# Altium schematic sheet LED_Matrix.SchDoc
size A2
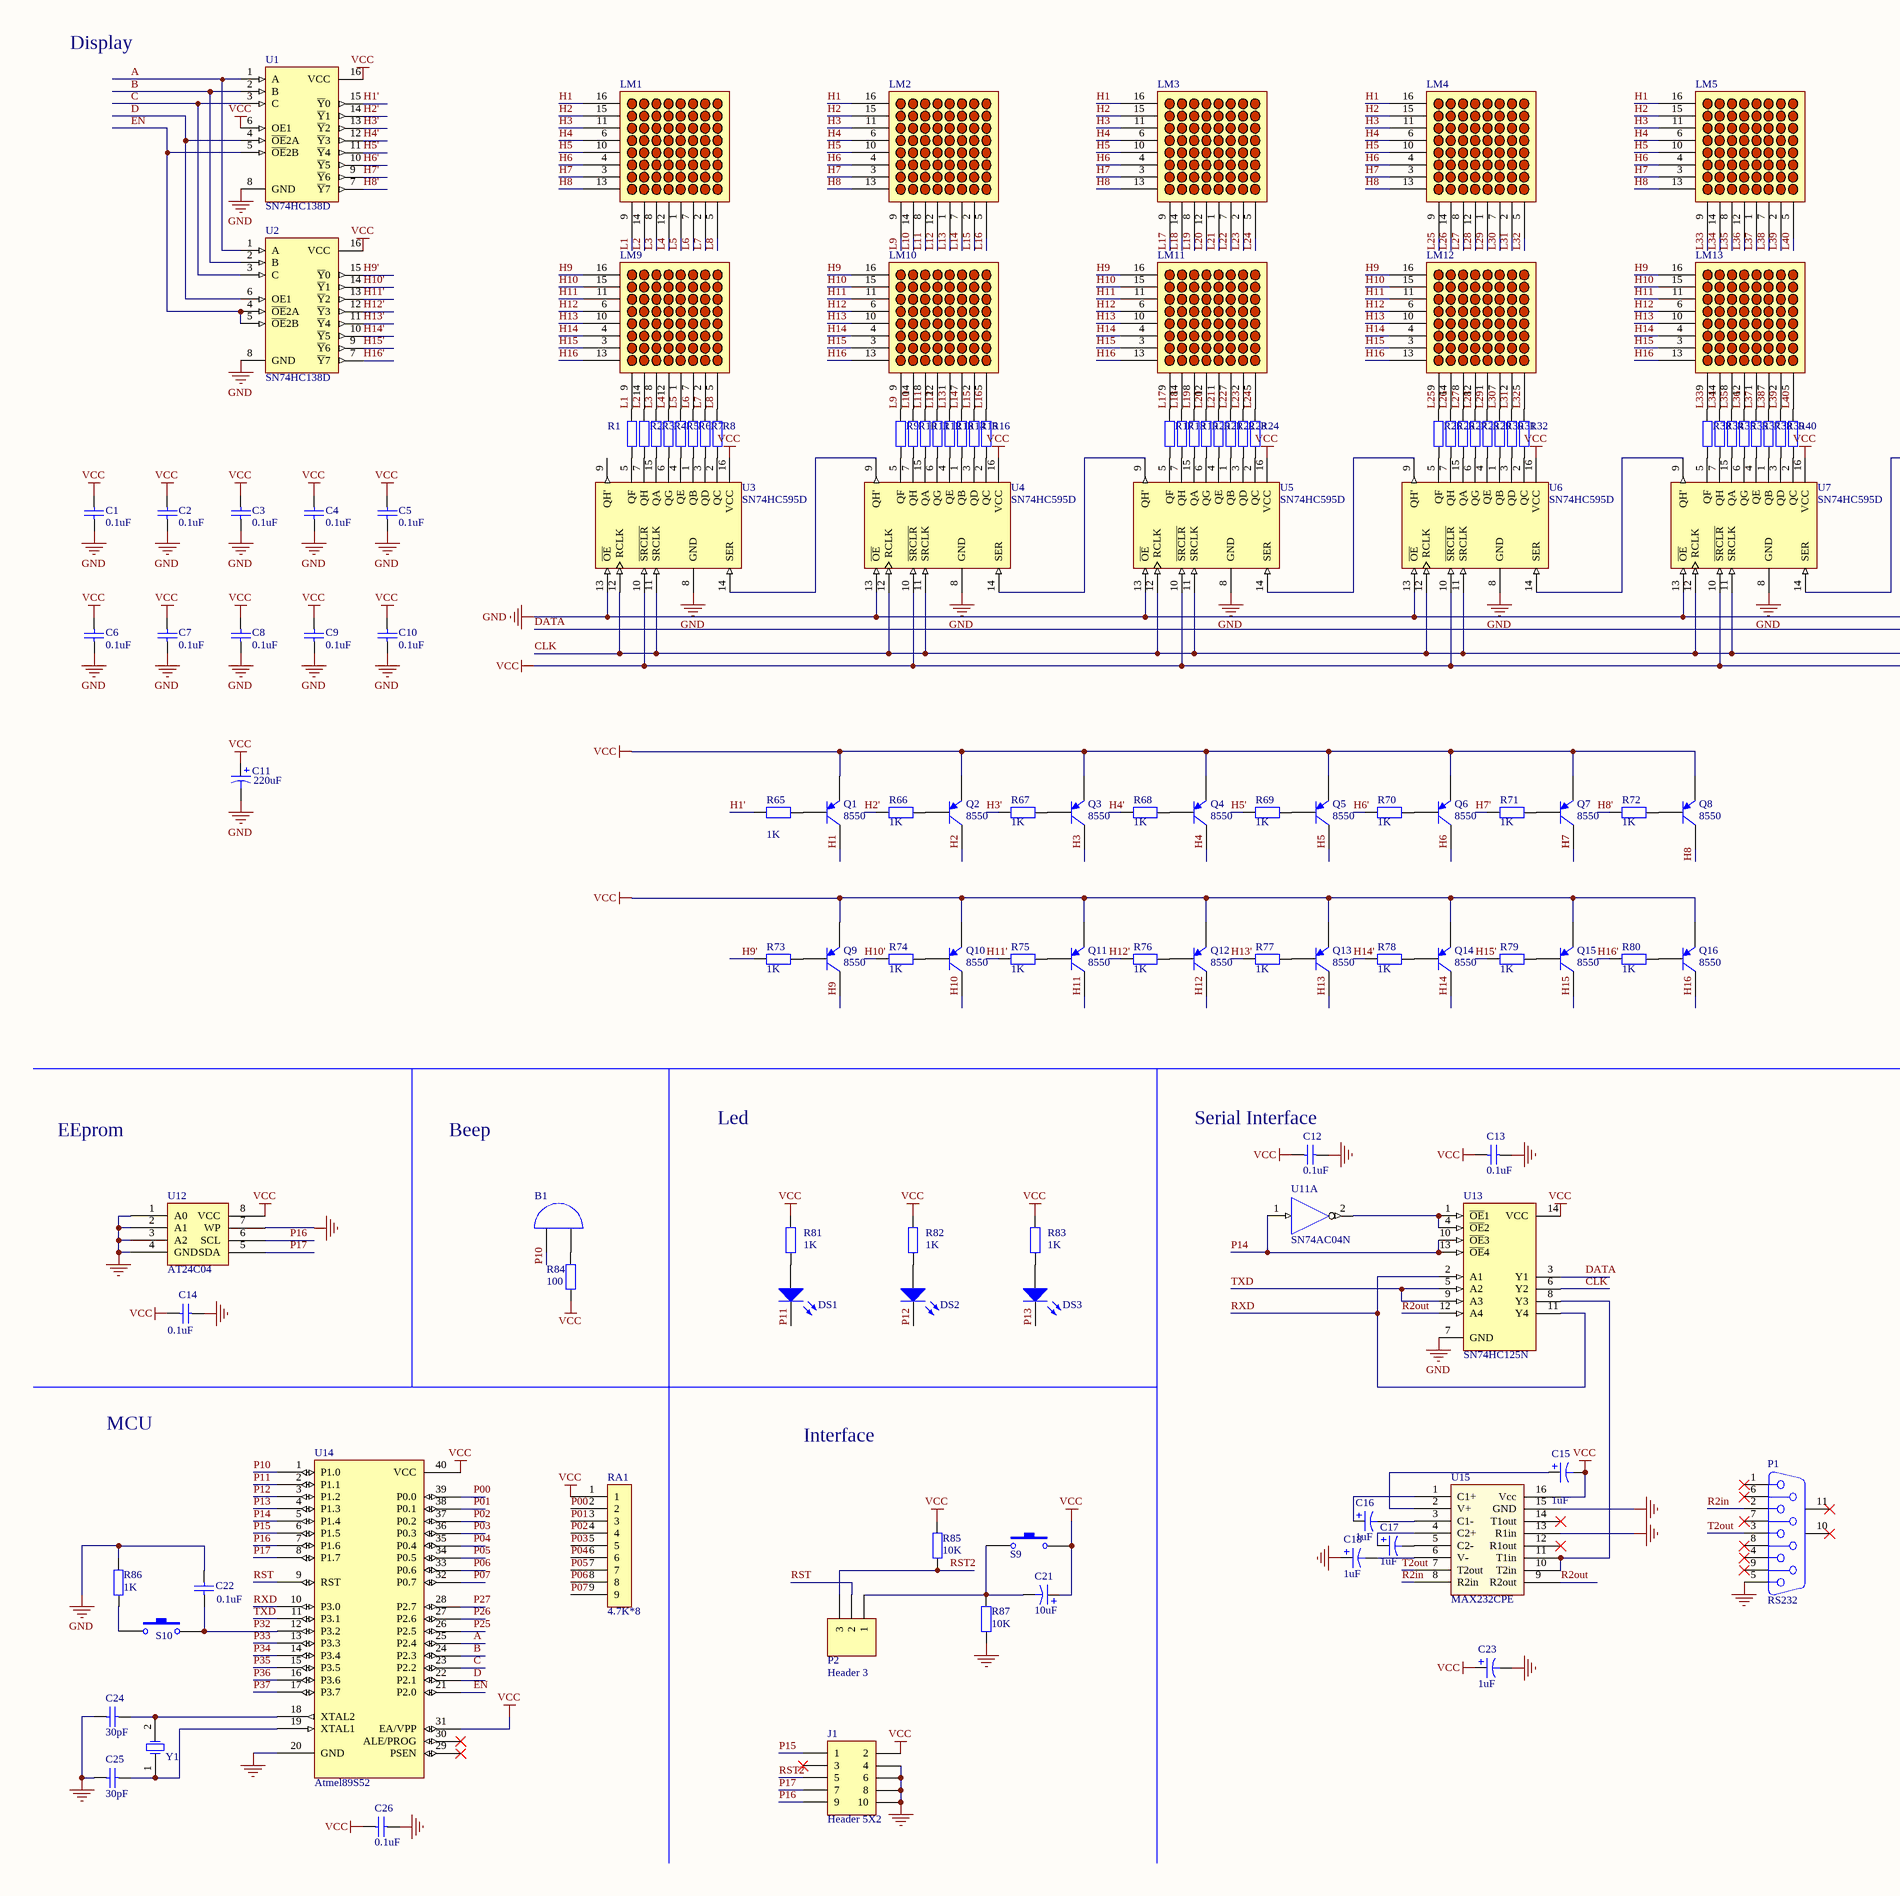
[diagram p0: LED_Matrix.SchDoc, left]
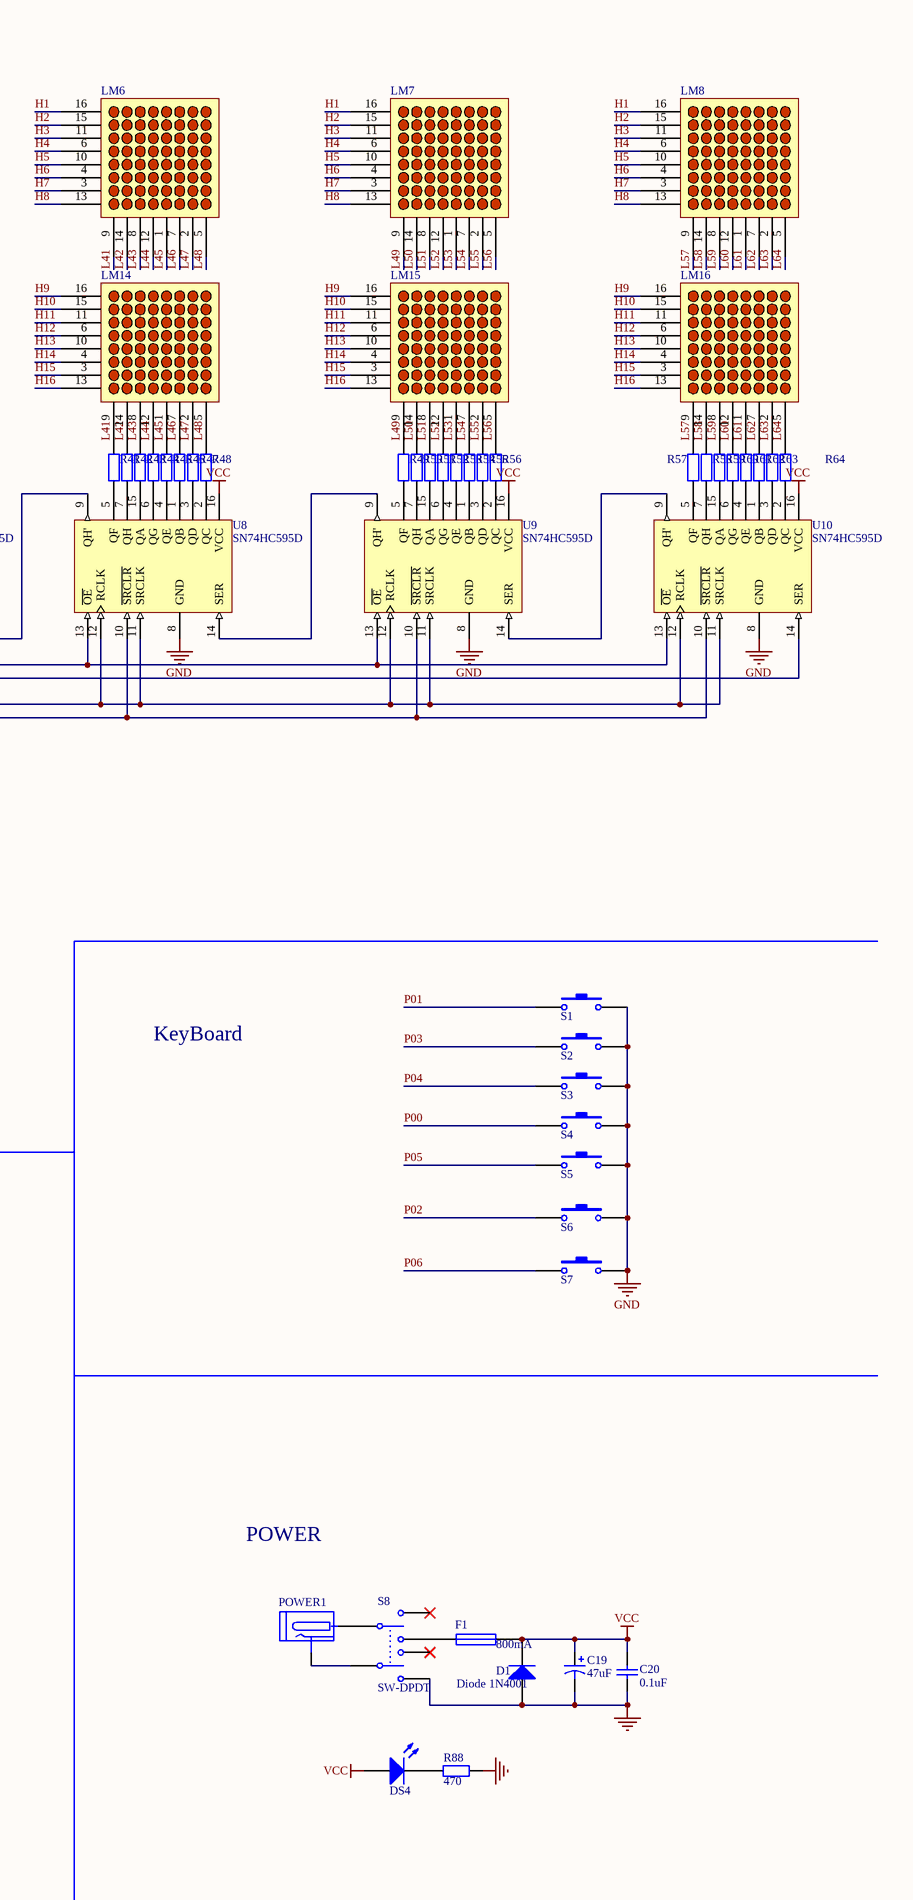
[diagram p1: LED_Matrix.SchDoc, right]

## Parts
B1  BEEP  [Buzzer]  (value not drawn)
C1  value 0.1uF  [C1206]  (hidden comment: Cap Semi)
C2  value 0.1uF  [C1206]  (hidden comment: Cap Semi)
C3  value 0.1uF  [C1206]  (hidden comment: Cap Semi)
C4  value 0.1uF  [C1206]  (hidden comment: Cap Semi)
C5  value 0.1uF  [C1206]  (hidden comment: Cap Semi)
C6  value 0.1uF  [C1206]  (hidden comment: Cap Semi)
C7  value 0.1uF  [C1206]  (hidden comment: Cap Semi)
C8  value 0.1uF  [C1206]  (hidden comment: Cap Semi)
C9  value 0.1uF  [C1206]  (hidden comment: Cap Semi)
C10  value 0.1uF  [C1206]  (hidden comment: Cap Semi)
C11  value 220uF  [CAPPR7.5-16x35]  (hidden comment: Cap Pol1)
C12  value 0.1uF  [VP32-3.2]  (hidden comment: Cap)
C13  value 0.1uF  [VP32-3.2]  (hidden comment: Cap)
C14  value 0.1uF  [VP32-3.2]  (hidden comment: Cap)
C15  value 1uF  [CAP-LED]  (hidden comment: CAP POL)
C16  value 1uF  [CAP-LED]  (hidden comment: CAP POL)
C17  value 1uF  [CAP-LED]  (hidden comment: CAP POL)
C18  value 1uF  [CAP-LED]  (hidden comment: CAP POL)
C19  value 47uF  [CAP-LED]  (hidden comment: CAP POL)
C20  value 0.1uF  [CAP]  (hidden comment: Cap)
C21  value 10uF  [CAP-LED]  (hidden comment: CAP POL)
C22  value 0.1uF  [VP32-3.2]  (hidden comment: Cap)
C23  value 1uF  [CAP-LED]  (hidden comment: CAP POL)
C24  value 30pF  [CAP]  (hidden comment: Cap)
C25  value 30pF  [CAP]  (hidden comment: Cap)
C26  value 0.1uF  [VP32-3.2]  (hidden comment: Cap)
D1  Diode 1N4001  [DIODE-0.4]
DS1  LED  [CAP-LED]  (value not drawn)
DS2  LED  [CAP-LED]  (value not drawn)
DS3  LED  [CAP-LED]  (value not drawn)
DS4  LED  [CAP-LED]  (value not drawn)
F1  value 800mA  [AXIAL-0.3]  (hidden comment: FUSE1)
J1  Header 5X2  [HDR2X5]
LM1  JM-M1088A-B  [LEDMatrix8]  (value not drawn)
LM2  JM-M1088A-B  [LEDMatrix8]  (value not drawn)
LM3  JM-M1088A-B  [LEDMatrix8]  (value not drawn)
LM4  JM-M1088A-B  [LEDMatrix8]  (value not drawn)
LM5  JM-M1088A-B  [LEDMatrix8]  (value not drawn)
LM6  JM-M1088A-B  [LEDMatrix8]  (value not drawn)
LM7  JM-M1088A-B  [LEDMatrix8]  (value not drawn)
LM8  JM-M1088A-B  [LEDMatrix8]  (value not drawn)
LM9  JM-M1088A-B  [LEDMatrix8]  (value not drawn)
LM10  JM-M1088A-B  [LEDMatrix8]  (value not drawn)
LM11  JM-M1088A-B  [LEDMatrix8]  (value not drawn)
LM12  JM-M1088A-B  [LEDMatrix8]  (value not drawn)
LM13  JM-M1088A-B  [LEDMatrix8]  (value not drawn)
LM14  JM-M1088A-B  [LEDMatrix8]  (value not drawn)
LM15  JM-M1088A-B  [LEDMatrix8]  (value not drawn)
LM16  JM-M1088A-B  [LEDMatrix8]  (value not drawn)
P1  RS232  [DSUB1.385-2H9]
P2  Header 3  [HDR1X3]
POWER1  POWER  [Power]  (value not drawn)
Q1  8550  [SOT-23B]
Q2  8550  [SOT-23B]
Q3  8550  [SOT-23B]
Q4  8550  [SOT-23B]
Q5  8550  [SOT-23B]
Q6  8550  [SOT-23B]
Q7  8550  [SOT-23B]
Q8  8550  [SOT-23B]
Q9  8550  [SOT-23B]
Q10  8550  [SOT-23B]
Q11  8550  [SOT-23B]
Q12  8550  [SOT-23B]
Q13  8550  [SOT-23B]
Q14  8550  [SOT-23B]
Q15  8550  [SOT-23B]
Q16  8550  [SOT-23B]
R1  RES  [0805]  (value not drawn)
R2  RES  [0805]  (value not drawn)
R3  RES  [0805]  (value not drawn)
R4  RES  [0805]  (value not drawn)
R5  RES  [0805]  (value not drawn)
R6  RES  [0805]  (value not drawn)
R7  RES  [0805]  (value not drawn)
R8  RES  [0805]  (value not drawn)
R9  RES  [0805]  (value not drawn)
R10  RES  [0805]  (value not drawn)
R11  RES  [0805]  (value not drawn)
R12  RES  [0805]  (value not drawn)
R13  RES  [0805]  (value not drawn)
R14  RES  [0805]  (value not drawn)
R15  RES  [0805]  (value not drawn)
R16  RES  [0805]  (value not drawn)
R17  RES  [0805]  (value not drawn)
R18  RES  [0805]  (value not drawn)
R19  RES  [0805]  (value not drawn)
R20  RES  [0805]  (value not drawn)
R21  RES  [0805]  (value not drawn)
R22  RES  [0805]  (value not drawn)
R23  RES  [0805]  (value not drawn)
R24  RES  [0805]  (value not drawn)
R25  RES  [0805]  (value not drawn)
R26  RES  [0805]  (value not drawn)
R27  RES  [0805]  (value not drawn)
R28  RES  [0805]  (value not drawn)
R29  RES  [0805]  (value not drawn)
R30  RES  [0805]  (value not drawn)
R31  RES  [0805]  (value not drawn)
R32  RES  [0805]  (value not drawn)
R33  RES  [0805]  (value not drawn)
R34  RES  [0805]  (value not drawn)
R35  RES  [0805]  (value not drawn)
R36  RES  [0805]  (value not drawn)
R37  RES  [0805]  (value not drawn)
R38  RES  [0805]  (value not drawn)
R39  RES  [0805]  (value not drawn)
R40  RES  [0805]  (value not drawn)
R41  RES  [0805]  (value not drawn)
R42  RES  [0805]  (value not drawn)
R43  RES  [0805]  (value not drawn)
R44  RES  [0805]  (value not drawn)
R45  RES  [0805]  (value not drawn)
R46  RES  [0805]  (value not drawn)
R47  RES  [0805]  (value not drawn)
R48  RES  [0805]  (value not drawn)
R49  RES  [0805]  (value not drawn)
R50  RES  [0805]  (value not drawn)
R51  RES  [0805]  (value not drawn)
R52  RES  [0805]  (value not drawn)
R53  RES  [0805]  (value not drawn)
R54  RES  [0805]  (value not drawn)
R55  RES  [0805]  (value not drawn)
R56  RES  [0805]  (value not drawn)
R57  RES  [0805]  (value not drawn)
R58  RES  [0805]  (value not drawn)
R59  RES  [0805]  (value not drawn)
R60  RES  [0805]  (value not drawn)
R61  RES  [0805]  (value not drawn)
R62  RES  [0805]  (value not drawn)
R63  RES  [0805]  (value not drawn)
R64  RES  [0805]  (value not drawn)
R65  value 1K  [0805]  (hidden comment: RES)
R66  value 1K  [0805]  (hidden comment: RES)
R67  value 1K  [0805]  (hidden comment: RES)
R68  value 1K  [0805]  (hidden comment: RES)
R69  value 1K  [0805]  (hidden comment: RES)
R70  value 1K  [0805]  (hidden comment: RES)
R71  value 1K  [0805]  (hidden comment: RES)
R72  value 1K  [0805]  (hidden comment: RES)
R73  value 1K  [0805]  (hidden comment: RES)
R74  value 1K  [0805]  (hidden comment: RES)
R75  value 1K  [0805]  (hidden comment: RES)
R76  value 1K  [0805]  (hidden comment: RES)
R77  value 1K  [0805]  (hidden comment: RES)
R78  value 1K  [0805]  (hidden comment: RES)
R79  value 1K  [0805]  (hidden comment: RES)
R80  value 1K  [0805]  (hidden comment: RES)
R81  value 1K  [AXIAL-0.4]  (hidden comment: RES)
R82  value 1K  [AXIAL-0.4]  (hidden comment: RES)
R83  value 1K  [AXIAL-0.4]  (hidden comment: RES)
R84  value 100  [AXIAL-0.4]  (hidden comment: RES)
R85  value 10K  [AXIAL-0.4]  (hidden comment: RES)
R86  value 1K  [AXIAL-0.4]  (hidden comment: RES)
R87  value 10K  [AXIAL-0.4]  (hidden comment: RES)
R88  value 470  [AXIAL-0.4]  (hidden comment: RES)
RA1  value 4.7K*8  [HDR1X9]  (hidden comment: Res Arry)
S1  SW-PB  [key]  (value not drawn)
S2  SW-PB  [key]  (value not drawn)
S3  SW-PB  [key]  (value not drawn)
S4  SW-PB  [key]  (value not drawn)
S5  SW-PB  [key]  (value not drawn)
S6  SW-PB  [key]  (value not drawn)
S7  SW-PB  [key]  (value not drawn)
S8  SW-DPDT  [SWITCH-6]
S9  SW-PB  [key]  (value not drawn)
S10  SW-PB  [key]  (value not drawn)
U1  SN74HC138D  [D016_N]
U2  SN74HC138D  [D016_N]
U3  SN74HC595D  [D016_N]
U4  SN74HC595D  [D016_N]
U5  SN74HC595D  [D016_N]
U6  SN74HC595D  [D016_N]
U7  SN74HC595D  [D016_N]
U8  SN74HC595D  [D016_N]
U9  SN74HC595D  [D016_N]
U10  SN74HC595D  [D016_N]
U11  SN74AC04N  [N014]  (part A of 6)
U12  AT24C04  [DIP-8]
U13  SN74HC125N  [N014]
U14  Atmel89S52  [ATMEL89S52-DIP40]
U15  MAX232CPE  [DIP-16]
Y1  XTAL  [XTAL]  (value not drawn)

## Nets
GND: C1.1 C2.1 C3.1 C4.1 C5.1 C6.1 C7.1 C8.1 C9.1 C10.1 C11.2 C12.2 C13.2 C14.2 C18.1 C19.2 C20.2 C22.2 C23.2 C24.1 C25.1 C26.2 D1.1(A) J1.4 J1.6 J1.8 J1.10 P1.5 R86.2 R87.1 R88.2 S1.2 S2.2 S3.2 S4.2 S5.2 S6.2 S7.2 S8.6 U1.8(GND) U2.8(GND) U3.8(GND) U3.13(~{OE}) U4.8(GND) U4.13(~{OE}) U5.8(GND) U5.13(~{OE}) U6.8(GND) U6.13(~{OE}) U7.8(GND) U7.13(~{OE}) U8.8(GND) U8.13(~{OE}) U9.8(GND) U9.13(~{OE}) U10.8(GND) U10.13(~{OE}) U11.7(GND) U12.1(A0) U12.2(A1) U12.3(A2) U12.4(GND) U12.7(WP) U13.7(GND) U14.20(GND) U15.13(R1in) U15.15(GND)
VCC: C1.2 C2.2 C3.2 C4.2 C5.2 C6.2 C7.2 C8.2 C9.2 C10.2 C11.1 C12.1 C13.1 C14.1 C15.2 C19.1 C20.1 C21.1 C23.1 C26.1 D1.2(K) DS4.1(A) F1.2 J1.2 Q1.3(E) Q2.3(E) Q3.3(E) Q4.3(E) Q5.3(E) Q6.3(E) Q7.3(E) Q8.3(E) Q9.3(E) Q10.3(E) Q11.3(E) Q12.3(E) Q13.3(E) Q14.3(E) Q15.3(E) Q16.3(E) R81.2 R82.2 R83.2 R84.2 R85.1 RA1.1 S9.2 U1.6(OE1) U1.16(VCC) U2.16(VCC) U3.10(~{SRCLR}) U3.16(VCC) U4.10(~{SRCLR}) U4.16(VCC) U5.10(~{SRCLR}) U5.16(VCC) U6.10(~{SRCLR}) U6.16(VCC) U7.10(~{SRCLR}) U7.16(VCC) U8.10(~{SRCLR}) U8.16(VCC) U9.10(~{SRCLR}) U9.16(VCC) U10.10(~{SRCLR}) U10.16(VCC) U11.14(VCC) U12.8(VCC) U13.14(VCC) U14.31(EA/VPP) U14.40(VCC) U15.16(Vcc)
A: U1.1(A) U2.1(A) U14.25(P2.4)
B: U1.2(B) U2.2(B) U14.24(P2.3)
C: U1.3(C) U2.3(C) U14.23(P2.2)
CLK: U3.11(SRCLK) U3.12(RCLK) U4.11(SRCLK) U4.12(RCLK) U5.11(SRCLK) U5.12(RCLK) U6.11(SRCLK) U6.12(RCLK) U7.11(SRCLK) U7.12(RCLK) U8.11(SRCLK) U8.12(RCLK) U9.11(SRCLK) U9.12(RCLK) U10.11(SRCLK) U10.12(RCLK) U13.6(Y2)
D: U1.4(~{OE}2A) U2.6(OE1) U14.22(P2.1)
DATA: U10.14(SER) U13.3(Y1)
EN: U1.5(~{OE}2B) U2.4(~{OE}2A) U2.5(~{OE}2B) U14.21(P2.0)
H1: LM1.16 LM2.16 LM3.16 LM4.16 LM5.16 LM6.16 LM7.16 LM8.16 Q1.1(C)
H1': R65.1 U1.15(~{Y}0)
H2: LM1.15 LM2.15 LM3.15 LM4.15 LM5.15 LM6.15 LM7.15 LM8.15 Q2.1(C)
H2': R66.1 U1.14(~{Y}1)
H3: LM1.11 LM2.11 LM3.11 LM4.11 LM5.11 LM6.11 LM7.11 LM8.11 Q3.1(C)
H3': R67.1 U1.13(~{Y}2)
H4: LM1.6 LM2.6 LM3.6 LM4.6 LM5.6 LM6.6 LM7.6 LM8.6 Q4.1(C)
H4': R68.1 U1.12(~{Y}3)
H5: LM1.10 LM2.10 LM3.10 LM4.10 LM5.10 LM6.10 LM7.10 LM8.10 Q5.1(C)
H5': R69.1 U1.11(~{Y}4)
H6: LM1.4 LM2.4 LM3.4 LM4.4 LM5.4 LM6.4 LM7.4 LM8.4 Q6.1(C)
H6': R70.1 U1.10(~{Y}5)
H7: LM1.3 LM2.3 LM3.3 LM4.3 LM5.3 LM6.3 LM7.3 LM8.3 Q7.1(C)
H7': R71.1 U1.9(~{Y}6)
H8: LM1.13 LM2.13 LM3.13 LM4.13 LM5.13 LM6.13 LM7.13 LM8.13 Q8.1(C)
H8': R72.1 U1.7(~{Y}7)
H9: LM9.16 LM10.16 LM11.16 LM12.16 LM13.16 LM14.16 LM15.16 LM16.16 Q9.1(C)
H9': R73.1 U2.15(~{Y}0)
H10: LM9.15 LM10.15 LM11.15 LM12.15 LM13.15 LM14.15 LM15.15 LM16.15 Q10.1(C)
H10': R74.1 U2.14(~{Y}1)
H11: LM9.11 LM10.11 LM11.11 LM12.11 LM13.11 LM14.11 LM15.11 LM16.11 Q11.1(C)
H11': R75.1 U2.13(~{Y}2)
H12: LM9.6 LM10.6 LM11.6 LM12.6 LM13.6 LM14.6 LM15.6 LM16.6 Q12.1(C)
H12': R76.1 U2.12(~{Y}3)
H13: LM9.10 LM10.10 LM11.10 LM12.10 LM13.10 LM14.10 LM15.10 LM16.10 Q13.1(C)
H13': R77.1 U2.11(~{Y}4)
H14: LM9.4 LM10.4 LM11.4 LM12.4 LM13.4 LM14.4 LM15.4 LM16.4 Q14.1(C)
H14': R78.1 U2.10(~{Y}5)
H15: LM9.3 LM10.3 LM11.3 LM12.3 LM13.3 LM14.3 LM15.3 LM16.3 Q15.1(C)
H15': R79.1 U2.9(~{Y}6)
H16: LM9.13 LM10.13 LM11.13 LM12.13 LM13.13 LM14.13 LM15.13 LM16.13 Q16.1(C)
H16': R80.1 U2.7(~{Y}7)
L1: LM1.9 LM9.9 R1.2
L2: LM1.14 LM9.14 R2.2
L3: LM1.8 LM9.8 R3.2
L4: LM1.12 LM9.12 R4.2
L5: LM1.1 LM9.1 R5.2
L6: LM1.7 LM9.7 R6.2
L7: LM1.2 LM9.2 R7.2
L8: LM1.5 LM9.5 R8.2
L9: LM2.9 LM10.9 R9.2
L10: LM2.14 LM10.14 R10.2
L11: LM2.8 LM10.8 R11.2
L12: LM2.12 LM10.12 R12.2
L13: LM2.1 LM10.1 R13.2
L14: LM2.7 LM10.7 R14.2
L15: LM2.2 LM10.2 R15.2
L16: LM2.5 LM10.5 R16.2
L17: LM3.9 LM11.9 R17.2
L18: LM3.14 LM11.14 R18.2
L19: LM3.8 LM11.8 R19.2
L20: LM3.12 LM11.12 R20.2
L21: LM3.1 LM11.1 R21.2
L22: LM3.7 LM11.7 R22.2
L23: LM3.2 LM11.2 R23.2
L24: LM3.5 LM11.5 R24.2
L25: LM4.9 LM12.9 R25.2
L26: LM4.14 LM12.14 R26.2
L27: LM4.8 LM12.8 R27.2
L28: LM4.12 LM12.12 R28.2
L29: LM4.1 LM12.1 R29.2
L30: LM4.7 LM12.7 R30.2
L31: LM4.2 LM12.2 R31.2
L32: LM4.5 LM12.5 R32.2
L33: LM5.9 LM13.9 R33.2
L34: LM5.14 LM13.14 R34.2
L35: LM5.8 LM13.8 R35.2
L36: LM5.12 LM13.12 R36.2
L37: LM5.1 LM13.1 R37.2
L38: LM5.7 LM13.7 R38.2
L39: LM5.2 LM13.2 R39.2
L40: LM5.5 LM13.5 R40.2
L41: LM6.9 LM14.9 R41.2
L42: LM6.14 LM14.14 R42.2
L43: LM6.8 LM14.8 R43.2
L44: LM6.12 LM14.12 R44.2
L45: LM6.1 LM14.1 R45.2
L46: LM6.7 LM14.7 R46.2
L47: LM6.2 LM14.2 R47.2
L48: LM6.5 LM14.5 R48.2
L49: LM7.9 LM15.9 R49.2
L50: LM7.14 LM15.14 R50.2
L51: LM7.8 LM15.8 R51.2
L52: LM7.12 LM15.12 R52.2
L53: LM7.1 LM15.1 R53.2
L54: LM7.7 LM15.7 R54.2
L55: LM7.2 LM15.2 R55.2
L56: LM7.5 LM15.5 R56.2
L57: LM8.9 LM16.9 R57.2
L58: LM8.14 LM16.14 R58.2
L59: LM8.8 LM16.8 R59.2
L60: LM8.12 LM16.12 R60.2
L61: LM8.1 LM16.1 R61.2
L62: LM8.7 LM16.7 R62.2
L63: LM8.2 LM16.2 R63.2
L64: LM8.5 LM16.5 R64.2
P00: RA1.2 S4.1 U14.39(P0.0)
P01: RA1.3 S1.1 U14.38(P0.1)
P02: RA1.4 S6.1 U14.37(P0.2)
P03: RA1.5 S2.1 U14.36(P0.3)
P04: RA1.6 S3.1 U14.35(P0.4)
P05: RA1.7 S5.1 U14.34(P0.5)
P06: RA1.8 S7.1 U14.33(P0.6)
P07: RA1.9 U14.32(P0.7)
P10: B1.2(A) U14.1(P1.0)
P11: DS1.2(K) U14.2(P1.1)
P12: DS2.2(K) U14.3(P1.2)
P13: DS3.2(K) U14.4(P1.3)
P14: U11.1(A) U13.10(~{OE}3) U13.13(~{OE}4) U14.5(P1.4)
P15: J1.1 U14.6(P1.5)
P16: J1.9 U12.6(SCL) U14.7(P1.6)
P17: J1.7 U12.5(SDA) U14.8(P1.7)
P25: U14.26(P2.5)
P26: U14.27(P2.6)
P27: U14.28(P2.7)
P32: C22.1 S10.2 U14.12(P3.2)
P33: U14.13(P3.3)
P34: U14.14(P3.4)
P35: U14.15(P3.5)
P36: U14.16(P3.6)
P37: U14.17(P3.7)
R2in: P1.2 U15.8(R2in)
R2out: U13.12(A4) U15.9(R2out)
RST: P2.2 U14.9(RST)
RST2: J1.5 P2.3 R85.2
RXD: U13.2(A1) U13.11(Y4) U14.10(P3.0)
T2out: P1.3 U15.7(T2out)
TXD: U13.5(A2) U13.9(A3) U14.11(P3.1)
NetB1_1: B1.1(B) R84.1
NetC15_1: C15.1 U15.2(V+)
NetC16_1: C16.1 U15.1(C1+)
NetC16_2: C16.2 U15.3(C1-)
NetC17_1: C17.1 U15.4(C2+)
NetC17_2: C17.2 U15.5(C2-)
NetC18_2: C18.2 U15.6(V-)
NetC21_2: C21.2 P2.1 R87.2 S9.1
NetC24_2: C24.2 U14.18(XTAL2) Y1.2(OSC2)
NetC25_2: C25.2 U14.19(XTAL1) Y1.1(OSC1)
NetDS1_1: DS1.1(A) R81.1
NetDS2_1: DS2.1(A) R82.1
NetDS3_1: DS3.1(A) R83.1
NetDS4_2: DS4.2(K) R88.1
NetF1_1: F1.1 S8.3
NetPOWER1_1: POWER1.1 S8.1
NetPOWER1_2: POWER1.2 S8.4
NetQ1_2: Q1.2(B) R65.2
NetQ2_2: Q2.2(B) R66.2
NetQ3_2: Q3.2(B) R67.2
NetQ4_2: Q4.2(B) R68.2
NetQ5_2: Q5.2(B) R69.2
NetQ6_2: Q6.2(B) R70.2
NetQ7_2: Q7.2(B) R71.2
NetQ8_2: Q8.2(B) R72.2
NetQ9_2: Q9.2(B) R73.2
NetQ10_2: Q10.2(B) R74.2
NetQ11_2: Q11.2(B) R75.2
NetQ12_2: Q12.2(B) R76.2
NetQ13_2: Q13.2(B) R77.2
NetQ14_2: Q14.2(B) R78.2
NetQ15_2: Q15.2(B) R79.2
NetQ16_2: Q16.2(B) R80.2
NetR1_1: R1.1 U3.5(QF)
NetR2_1: R2.1 U3.7(QH)
NetR3_1: R3.1 U3.15(QA)
NetR4_1: R4.1 U3.6(QG)
NetR5_1: R5.1 U3.4(QE)
NetR6_1: R6.1 U3.1(QB)
NetR7_1: R7.1 U3.3(QD)
NetR8_1: R8.1 U3.2(QC)
NetR9_1: R9.1 U4.5(QF)
NetR10_1: R10.1 U4.7(QH)
NetR11_1: R11.1 U4.15(QA)
NetR12_1: R12.1 U4.6(QG)
NetR13_1: R13.1 U4.4(QE)
NetR14_1: R14.1 U4.1(QB)
NetR15_1: R15.1 U4.3(QD)
NetR16_1: R16.1 U4.2(QC)
NetR17_1: R17.1 U5.5(QF)
NetR18_1: R18.1 U5.7(QH)
NetR19_1: R19.1 U5.15(QA)
NetR20_1: R20.1 U5.6(QG)
NetR21_1: R21.1 U5.4(QE)
NetR22_1: R22.1 U5.1(QB)
NetR23_1: R23.1 U5.3(QD)
NetR24_1: R24.1 U5.2(QC)
NetR25_1: R25.1 U6.5(QF)
NetR26_1: R26.1 U6.7(QH)
NetR27_1: R27.1 U6.15(QA)
NetR28_1: R28.1 U6.6(QG)
NetR29_1: R29.1 U6.4(QE)
NetR30_1: R30.1 U6.1(QB)
NetR31_1: R31.1 U6.3(QD)
NetR32_1: R32.1 U6.2(QC)
NetR33_1: R33.1 U7.5(QF)
NetR34_1: R34.1 U7.7(QH)
NetR35_1: R35.1 U7.15(QA)
NetR36_1: R36.1 U7.6(QG)
NetR37_1: R37.1 U7.4(QE)
NetR38_1: R38.1 U7.1(QB)
NetR39_1: R39.1 U7.3(QD)
NetR40_1: R40.1 U7.2(QC)
NetR41_1: R41.1 U8.5(QF)
NetR42_1: R42.1 U8.7(QH)
NetR43_1: R43.1 U8.15(QA)
NetR44_1: R44.1 U8.6(QG)
NetR45_1: R45.1 U8.4(QE)
NetR46_1: R46.1 U8.1(QB)
NetR47_1: R47.1 U8.3(QD)
NetR48_1: R48.1 U8.2(QC)
NetR49_1: R49.1 U9.5(QF)
NetR50_1: R50.1 U9.7(QH)
NetR51_1: R51.1 U9.15(QA)
NetR52_1: R52.1 U9.6(QG)
NetR53_1: R53.1 U9.4(QE)
NetR54_1: R54.1 U9.1(QB)
NetR55_1: R55.1 U9.3(QD)
NetR56_1: R56.1 U9.2(QC)
NetR57_1: R57.1 U10.5(QF)
NetR58_1: R58.1 U10.7(QH)
NetR59_1: R59.1 U10.15(QA)
NetR60_1: R60.1 U10.6(QG)
NetR61_1: R61.1 U10.4(QE)
NetR62_1: R62.1 U10.1(QB)
NetR63_1: R63.1 U10.3(QD)
NetR64_1: R64.1 U10.2(QC)
NetR86_1: R86.1 S10.1
NetU3_14: U3.14(SER) U4.9(QH')
NetU4_14: U4.14(SER) U5.9(QH')
NetU5_14: U5.14(SER) U6.9(QH')
NetU6_14: U6.14(SER) U7.9(QH')
NetU7_14: U7.14(SER) U8.9(QH')
NetU8_14: U8.14(SER) U9.9(QH')
NetU9_14: U9.14(SER) U10.9(QH')
NetU11_2: U11.2(Y) U13.1(~{OE}1) U13.4(~{OE}2)
NetU13_8: U13.8(Y3) U15.10(T2in) U15.11(T1in)

Not connected (* = marked no-connect by the designer): J1 3*; P1 1* 4* 6* 7* 8* 9* 10(MH1)* 11(MH2)*; S8 2* 5*; U3 9(QH'); U14 29(PSEN)* 30(ALE/PROG)*; U15 12(R1out)* 14(T1out)*

## Notes on the sheet
- Display
- KeyBoard
- Led
- (near C12) Serial Interface
- EEprom
- Beep
- MCU
- POWER
- Interface

## Library data of the parts
C1-C10 = Cap Semi: Capacitor (Semiconductor SIM Model); Published: 8-Jun-2000; LatestRevisionDate: 17-Jul-2002; LatestRevisionNote: Re-released for DXP Platform.; PackageReference: C1206; Publisher: Altium Limited
C11 = Cap Pol1: Polarized Capacitor (Radial); Published: 8-Jun-2000; LatestRevisionDate: 17-Jul-2002; LatestRevisionNote: Re-released for DXP Platform.; PackageReference: RB7.6-15; Publisher: Altium Limited
C12-C14 C20 C22 C24-C26 = Cap: Capacitor; Published: 8-Jun-2000; LatestRevisionDate: 17-Jul-2002; LatestRevisionNote: Re-released for DXP Platform.; Publisher: Altium Limited
  C12-C14 C22 C26: PackageReference: RAD-0.3
C15-C19 C21 C23 = CAP POL: Polarized Capacitor (Axial); Published: 8-Jun-2000; LatestRevisionDate: 17-Jul-2002; LatestRevisionNote: Re-released for DXP Platform.; Publisher: Altium Limited
D1 = Diode 1N4001: 1 Amp General Purpose Rectifier; Revision 1: 11-Jul-2000: SIM Model Added.; Revision 2: 17-Jul-2002: Re-released for DXP Platform.; Package Information: Latest Revision: Aug-1999; Code - JEDEC: DO-204-AL; Published: 8-Jun-2000; Datasheet: Latest Revision: 1998; Package Reference: DO-41; Publisher: Altium Limited
J1 = Header 5X2: Header, 5-Pin, Dual row; LatestRevisionDate: 17-Jul-2002; LatestRevisionNote: Re-released for DXP Platform.; Publisher: Altium Limited
LM1-LM16 = LED Matrix 8
P1 = D Connector 9: Receptacle Assembly, 9 Position, Right Angle; PackageDocument: O; Positions: 9; Published: 15-Jun-2001; LatestRevisionDate: 17-Jul-2002; LatestRevisionNote: Re-released for DXP Platform.; DatasheetDocument: 1-Sep-1999; PackageReference: 788750; Publisher: Altium Limited; Orientation: Right Angle; Gender: Receptacle
P2 = Header 3: Header, 3-Pin; LatestRevisionDate: 17-Jul-2002; LatestRevisionNote: Re-released for DXP Platform.; Publisher: Altium Limited
Q1-Q16 = PNP: PNP Bipolar Transistor; Published: 8-Jun-2000; LatestRevisionDate: 17-Jul-2002; LatestRevisionNote: Re-released for DXP Platform.; PackageReference: SOT-23B; Publisher: Altium Limited; Code_JEDEC: SOT-23
R1-R88 = RES: Resistor; Published: 8-Jun-2000; LatestRevisionDate: 17-Jul-2002; LatestRevisionNote: Re-released for DXP Platform.; Publisher: Altium Limited
S8 = SW-DPDT: Double-Pole, Double-Throw Switch; Published: 24-Mar-1999; Revision: July-2002: Re-released for DXP Platform.; Publisher: Altium Limited
U1 U2 = SN74HC138D: 3-Line to 8-Line Decoder / Demultiplexer; Published: 8-Jun-2000; LatestRevisionDate: 13-Apr-2006; LatestRevisionNote: IPC-7351 Footprint Added.; DatasheetVersion: May-1997; PackageVersion: Jan-1998; PackageReference: D016; Publisher: Altium Limited; PackageDescription: 16-Pin Small Outline Integrated Circuit 1.27 mm Pitch; Code_IPC: SOIC127P600-16; ComponentLink1Description: Manufacturer Link; ComponentLink1URL: http://www.ti.com/; ComponentLink2Description: Datasheet; ComponentLink2URL: http://www-s.ti.com/sc/ds/sn74hc138.pdf
U3-U10 = SN74HC595D: 8-Bit Shift Register with 3-State Output Registers; Published: 8-Jun-2000; LatestRevisionDate: 13-Apr-2006; LatestRevisionNote: IPC-7351 Footprint Added.; DatasheetVersion: May-1997; PackageVersion: Jan-1998; PackageReference: D016; Publisher: Altium Limited; PackageDescription: 16-Pin Small Outline Integrated Circuit 1.27 mm Pitch; Code_IPC: SOIC127P600-16; ComponentLink1Description: Manufacturer Link; ComponentLink1URL: http://www.ti.com/; ComponentLink2Description: Datasheet; ComponentLink2URL: http://www-s.ti.com/sc/ds/sn74hc595.pdf
U11 = SN74AC04N: Hex Inverter; Published: 8-Jun-2000; LatestRevisionDate: 04-Mar-2005; LatestRevisionNote: Stylized 3D Model Added.; DatasheetVersion: Sep-1996; PackageVersion: Oct-1995; PackageReference: N014; Publisher: Altium Limited; PackageDescription: DIP; 14 Leads; Row Spacing 7.62 mm; Pitch 2.54 mm; ComponentLink1Description: Manufacturer Link; ComponentLink1URL: http://www.ti.com/; ComponentLink2Description: Datasheet; ComponentLink2URL: http://www-s.ti.com/sc/ds/sn74ac04.pdf; ComponentLink3Description: Packaging Specification; ComponentLink3URL: http://focus.ti.com/lit/ml/mpdi002c/mpdi002c.pdf
U13 = SN74HC125N: Quadruple Bus Buffer Gate with 3-State Outputs; Published: 8-Jun-2000; LatestRevisionDate: 06-Jun-2005; LatestRevisionNote: Stylized 3D Model Added.; DatasheetVersion: May-1997; PackageVersion: Oct-1995; PackageReference: N014; Publisher: Altium Limited; PackageDescription: DIP; 14 Leads; Row Spacing 7.62 mm; Pitch 2.54 mm; ComponentLink1Description: Manufacturer Link; ComponentLink1URL: http://www.ti.com/; ComponentLink2Description: Datasheet; ComponentLink2URL: http://www-s.ti.com/sc/ds/sn74hc125.pdf
U15 = MAX232
Y1 = XTAL: Crystal Oscillator; Published: 8-Jun-2000; Revision: July-2002: Re-released for DXP Platform.; Publisher: Altium Limited